# Altium schematic sheet XIAO ESP32-C3.schdoc
size 72 x 53 mm
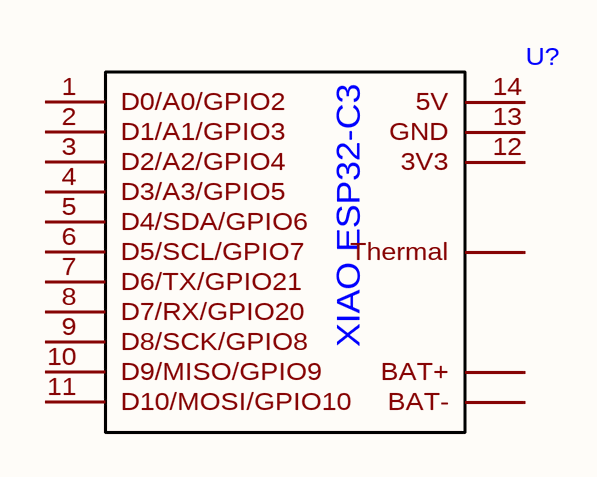
[diagram p0: XIAO ESP32-C3.schdoc]

## Parts
U?  (no value)  [MOD-14_22-SMD-L21-W18-P2.54-LS16-TR-EP_XIAO_ESP32C3]

## Nets

Not connected (* = marked no-connect by the designer): U? 1(D0/A0/GPIO2) 2(D1/A1/GPIO3) 3(D2/A2/GPIO4) 4(D3/A3/GPIO5) 5(D4/SDA/GPIO6) 6(D5/SCL/GPIO7) 7(D6/TX/GPIO21) 8(D7/RX/GPIO20) 9(D8/SCK/GPIO8) 10(D9/MISO/GPIO9) 11(D10/MOSI/GPIO10) 12(3V3) 13(GND) 14(5V) BAT+ BAT- Thermal

## Library data of the parts
U? = XIAO ESP32-C3